# Altium schematic sheet SR Latch.SchDoc: SR Latch
size 292 x 193 mm; SheetNumber: 5; SheetTotal: 5
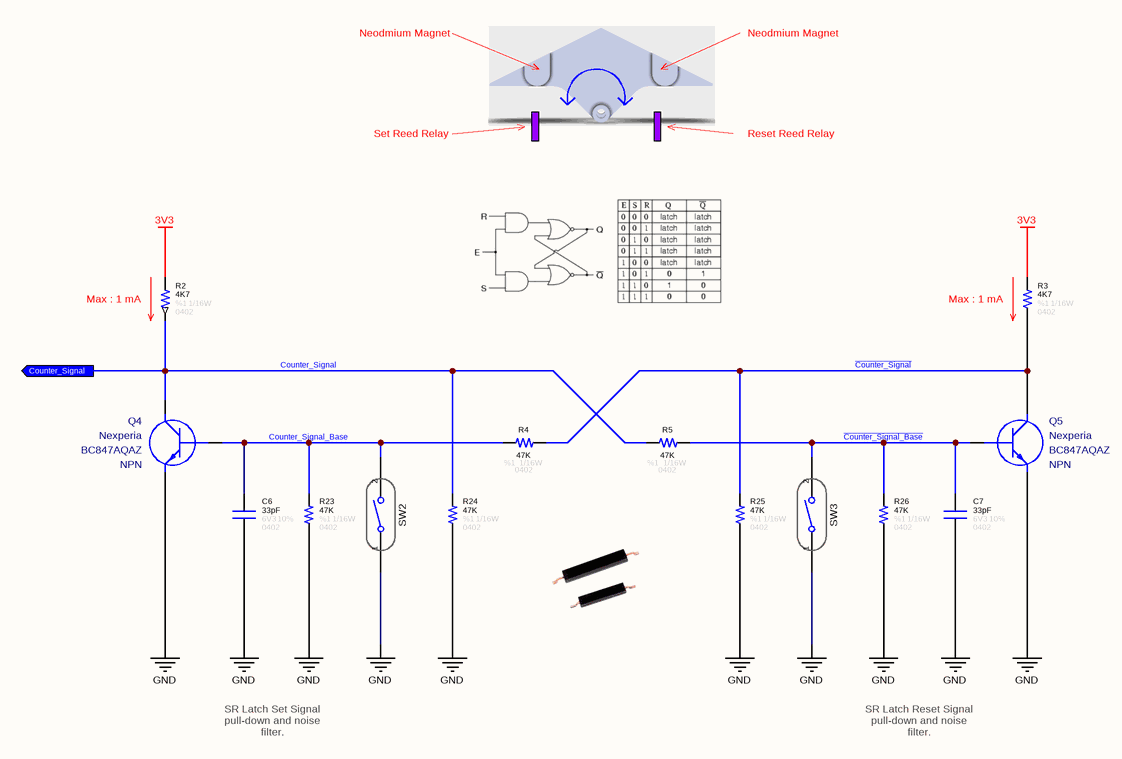
[diagram p0: SR Latch.SchDoc]

## Parts
C6  value 33pF  Tolerance: 10%  Case: 0402  Voltage: 6V3  [CAPACITOR_0402]
C7  value 33pF  Tolerance: 10%  Case: 0402  Voltage: 6V3  [CAPACITOR_0402]
Q4  Manufacturer Name: Nexperia  Manufacturer Part Number: BC847AQAZ  Polarity: NPN  [SOT1215]
Q5  Manufacturer Name: Nexperia  Manufacturer Part Number: BC847AQAZ  Polarity: NPN  [SOT1215]
R2  value 4K7  Tolerance: %1  Case: 0402  Power: 1/16W  [RESISTOR_0402]
R3  value 4K7  Tolerance: %1  Case: 0402  Power: 1/16W  [RESISTOR_0402]
R4  value 47K  Tolerance: %1  Case: 0402  Power: 1/16W  [RESISTOR_0402]
R5  value 47K  Tolerance: %1  Case: 0402  Power: 1/16W  [RESISTOR_0402]
R23  value 47K  Tolerance: %1  Case: 0402  Power: 1/16W  [RESISTOR_0402]
R24  value 47K  Tolerance: %1  Case: 0402  Power: 1/16W  [RESISTOR_0402]
R25  value 47K  Tolerance: %1  Case: 0402  Power: 1/16W  [RESISTOR_0402]
R26  value 47K  Tolerance: %1  Case: 0402  Power: 1/16W  [RESISTOR_0402]
SW2  (no value)  [REED Relay]
SW3  (no value)  [REED Relay]

## Ports
Counter_Signal (out)

## Nets
3V3: R2.2 R3.2
GND: C6.1 C7.1 Q4.2(E) Q5.2(E) R23.1 R24.1 R25.1 R26.1 SW2.1(NC) SW3.1(NC)
~{Counter_Signal}: Q5.3(C) R3.1 R4.1 R25.2
~{Counter_Signal_Base}: C7.2 Q5.1(B) R5.1 R26.2 SW3.2(COM)
Counter_Signal: Q4.3(C) R2.1 R5.2 R24.2 ; port Counter_Signal
Counter_Signal_Base: C6.2 Q4.1(B) R4.2 R23.2 SW2.2(COM)

## Notes on the sheet
- Neodmium Magnet
- Set Reed Relay
- Reset Reed Relay
- (near R2) Max : 1 mA
- (near R3) Max : 1 mA
- SR Latch Set Signal pull-down and noise filter.
- SR Latch Reset Signal pull-down and noise filter.
- © 2021 All rights reserved.
  This document may not, in whole or in part, be copied, photocopied, reproduced, translated or converted to any electronic or machine readable from without prior written permission of Mehmet Günce Akkoyun.
  Engineer contact : akkoyun@me.com
- Property of
- Engineer :
- Date :
- Size :
- A4
- Time :
- Project :
- Page :
- /
- Customer :
- Product ID :
- Module ID :
- Version :
- File :
- Revision :

## Library data of the parts
C6 C7 = Capacitor - 33pF [0402-6V3]: Capacitor - 33pF [0402] (Ceramic); Manufacturer Name: Kemet; Manufacturer Part Number: C0402C330J9RACAUTO; ComponentLink1Description: DataSheet; ComponentLink1URL: https://api.kemet.com/component-edge/download/datasheet/C0402C330J9RACAUTO.pdf; ComponentLink2Description: Mouser; ComponentLink2URL: https://www.mouser.com/Search/Refine.aspx?Keyword=80-C0402C330J9RAUTO
Q4 Q5 = Transistor - BC847: Bipolar NPN Transistors; Case: DFN-1010D-3
R2 R3 = Resistor - 4K7 [0402]: Thick Film Resistors - SMD 1/16 W 4.7 KOhm 1%; Manufacturer Name: Vishay; Manufacturer Part Number: CRCW04024K70FKED; ComponentLink1Description: DataSheet; ComponentLink1URL: https://www.mouser.com.tr/datasheet/2/427/dcrcwe3-1762152.pdf; ComponentLink2Description: Mouser; ComponentLink2URL: https://www.mouser.com.tr/ProductDetail/Vishay-Dale/CRCW04024K70FKED?qs=sGAEpiMZZMu61qfTUdNhG7nHf%2F6MTUn3HadIdDQu24Q%3D
R4 R5 R23-R26 = Resistor - 47K [0402]: Thick Film Resistors - SMD 1/16 W 47 KOhm 1%; Manufacturer Name: Vishay; Manufacturer Part Number: CRCW040247K0FKED; ComponentLink1Description: DataSheet; ComponentLink1URL: https://www.mouser.com.tr/datasheet/2/427/dcrcwe3-1762152.pdf; ComponentLink2Description: Mouser; ComponentLink2URL: https://www.mouser.com.tr/ProductDetail/Vishay-Dale/CRCW040247K0FKED?qs=sGAEpiMZZMu61qfTUdNhG2DpbjADlD3GL%252B3h1elTxqU%3D
SW2 SW3 = Switch - Reed Relay: Reed relay - SMD 11.7 mm; Manufacturer Name: Ryazan Metal Ceramic; Manufacturer Part Number: MKA-10110MS; Height: 3mm